# EAGLE design led80tiny85 (EAGLE 9.5.2)
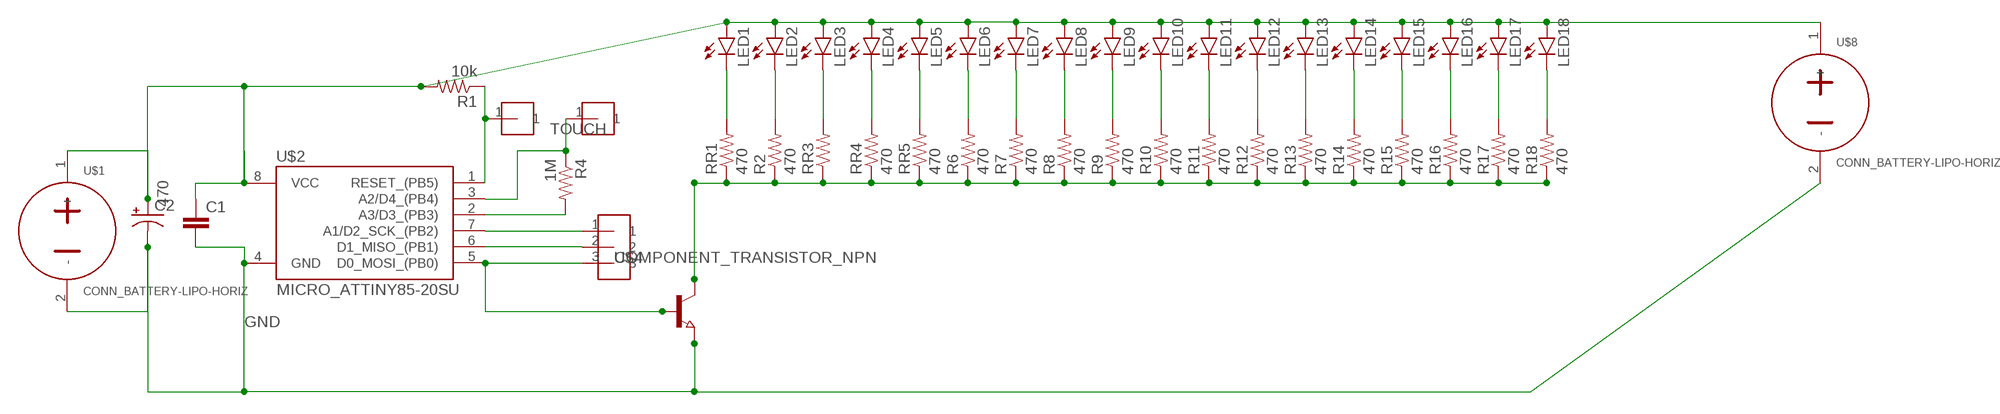
[diagram p0: schematic, sheet 1]

## Parts
C1  COMPONENT_CAP-0805  [0805]
C2  COMPONENT_CAP_POL-8MM  [CAP_RADIAL_CAN_6.3MM]
LED1  LED-0805  [CHIP-LED0805]
LED2  LED-0805  [CHIP-LED0805]
LED3  LED-0805  [CHIP-LED0805]
LED4  LED-0805  [CHIP-LED0805]
LED5  LED-0805  [CHIP-LED0805]
LED6  LED-0805  [CHIP-LED0805]
LED7  LED-0805  [CHIP-LED0805]
LED8  LED-0805  [CHIP-LED0805]
LED9  LED-0805  [CHIP-LED0805]
LED10  LED-0805  [CHIP-LED0805]
LED11  LED-0805  [CHIP-LED0805]
LED12  LED-0805  [CHIP-LED0805]
LED13  LED-0805  [CHIP-LED0805]
LED14  LED-0805  [CHIP-LED0805]
LED15  LED-0805  [CHIP-LED0805]
LED16  LED-0805  [CHIP-LED0805]
LED17  LED-0805  [CHIP-LED0805]
LED18  LED-0805  [CHIP-LED0805]
R1  10k  COMPONENT_RESISTOR-0805  [0805]
R2  470  COMPONENT_RESISTOR-0805  [0805]
R4  1M  COMPONENT_RESISTOR-0805  [0805]
R6  470  COMPONENT_RESISTOR-0805  [0805]
R7  470  COMPONENT_RESISTOR-0805  [0805]
R8  470  COMPONENT_RESISTOR-0805  [0805]
R9  470  COMPONENT_RESISTOR-0805  [0805]
R10  470  COMPONENT_RESISTOR-0805  [0805]
R11  470  COMPONENT_RESISTOR-0805  [0805]
R12  470  COMPONENT_RESISTOR-0805  [0805]
R13  470  COMPONENT_RESISTOR-0805  [0805]
R14  470  COMPONENT_RESISTOR-0805  [0805]
R15  470  COMPONENT_RESISTOR-0805  [0805]
R16  470  COMPONENT_RESISTOR-0805  [0805]
R17  470  COMPONENT_RESISTOR-0805  [0805]
R18  470  COMPONENT_RESISTOR-0805  [0805]
RR1  470  COMPONENT_RESISTOR-0805  [0805]
RR3  470  COMPONENT_RESISTOR-0805  [0805]
RR4  470  COMPONENT_RESISTOR-0805  [0805]
RR5  470  COMPONENT_RESISTOR-0805  [0805]
U$1  CONN_BATTERY-LIPO-HORIZ  [JST-PH-2-SMT-RA]
U$2  MICRO_ATTINY85-20SU  [SOIC8]
U$4  COMPONENT_TRANSISTOR_NPN  [SOT23]
U$5  HEADER-1-TESTPOINT  [TESTPOINT-1]
U$6  HEADER-1-TESTPOINT  [TESTPOINT-1]
U$7  HEADER-3-TESTPOINT  [TESTPOINT-3]
U$8  CONN_BATTERY-LIPO-HORIZ  [JST-PH-2-SMT-RA]

## Nets
GND: C1.2 C2.- U$1.2(-) U$2.4(GND) U$4.2(E) U$8.2(-)
N$1: R1.1 U$2.1(RESET_(PB5)) U$6.1
N$2: C1.1 C2.+ LED1.A LED2.A LED3.A LED4.A LED5.A LED6.A LED7.A LED8.A LED9.A LED10.A LED11.A LED12.A LED13.A LED14.A LED15.A LED16.A LED17.A LED18.A R1.2 U$1.1(+) U$2.8(VCC) U$8.1(+)
N$3: U$2.5(D0_MOSI_(PB0)) U$4.1(B) U$7.3
N$4: R2.1 R6.1 R7.1 R8.1 R9.1 R10.1 R11.1 R12.1 R13.1 R14.1 R15.1 R16.1 R17.1 R18.1 RR1.1 RR3.1 RR4.1 RR5.1 U$4.3(C)
N$6: R4.2 U$2.2(A3/D3_(PB3))
N$7: U$2.7(A1/D2_SCK_(PB2)) U$7.1
N$8: U$2.6(D1_MISO_(PB1)) U$7.2
N$9: LED1.C RR1.2
N$11: LED2.C R2.2
N$12: LED3.C RR3.2
N$13: LED4.C RR4.2
N$14: LED5.C RR5.2
N$15: LED6.C R6.2
N$16: LED7.C R7.2
N$17: LED8.C R8.2
N$18: LED9.C R9.2
N$19: LED10.C R10.2
N$20: LED11.C R11.2
N$21: LED12.C R12.2
N$22: LED13.C R13.2
N$23: LED14.C R14.2
N$24: LED15.C R15.2
N$25: LED16.C R16.2
N$27: LED17.C R17.2
N$28: LED18.C R18.2
TOUCH: R4.1 U$2.3(A2/D4_(PB4)) U$5.1

## Library data of the parts
C1 = homemade-hardware:COMPONENT_CAP: Capacitor Standard 0603 ceramic capacitor, and 0.1" leaded capacitor.
C2 = homemade-hardware:COMPONENT_CAP_POL: Capacitor Polarized These are standard SMD and PTH capacitors. Normally 47uF, 100uF, and 470uF in electrolytic and tantalum varieties. Always verify the external diameter of the through hole cap, it varies with capacity, voltage, and manufacturer. The EIA devices should be standard.
LED1-LED18 = homemade-hardware:LED: LEDs Standard schematic elements and footprints for 5mm, 3mm, 1206, and 0603 sized LEDs. 5mm - Spark Fun Electronics SKU : COM-00529 (and others)
R1 R2 R4 R6-R18 RR1 RR3-RR5 = homemade-hardware:COMPONENT_RESISTOR
U$1 U$8 = homemade-hardware:CONN_BATTERY
U$2 = homemade-hardware:MICRO_ATTINY85
U$4 = homemade-hardware:COMPONENT_TRANSISTOR_NPN: BSS806NH6327XTSA1 <https://www.digikey.com/product-detail/en/infineon-technologies/BSS806NH6327XTSA1/BSS806NH6327XTSA1DKR-ND/3196843>: NPN Moseft Transistor - 20V 2.3A; PN: BSS806NH6327XTSA1
U$5 U$6 = homemade-hardware:HEADER-1: M20-8890845 <https://www.digikey.com/products/en?keywords=952-3236-ND>: Horizontal Male SMD Headers M20-7910842R <https://www.digikey.com/product-detail/en/harwin-inc/M20-7910842R/952-3200-6-ND/6559341>: Horizontal Female SMD Headers
U$7 = homemade-hardware:HEADER-3: NPTC081KFXC-RC <https://www.digikey.com/product-detail/en/sullins-connector-solutions/NPTC081KFXC-RC/S5600-ND/776058>: Vertical Female SMD Headers TSM-110-01-T-SV <https://www.digikey.com/product-detail/en/samtec-inc/TSM-110-01-T-SV/SAM12267-ND/6691889>: Vertical Male SMD Headers M20-8890845 <https://www.digikey.com/products/en?keywords=952-3236-ND>: Horizontal Male SMD Headers M20-7910842R <https://www.digikey.com/product-detail/en/harwin-inc/M20-7910842R/952-3200-6-ND/6559341>: Horizontal Female SMD Headers

## Board
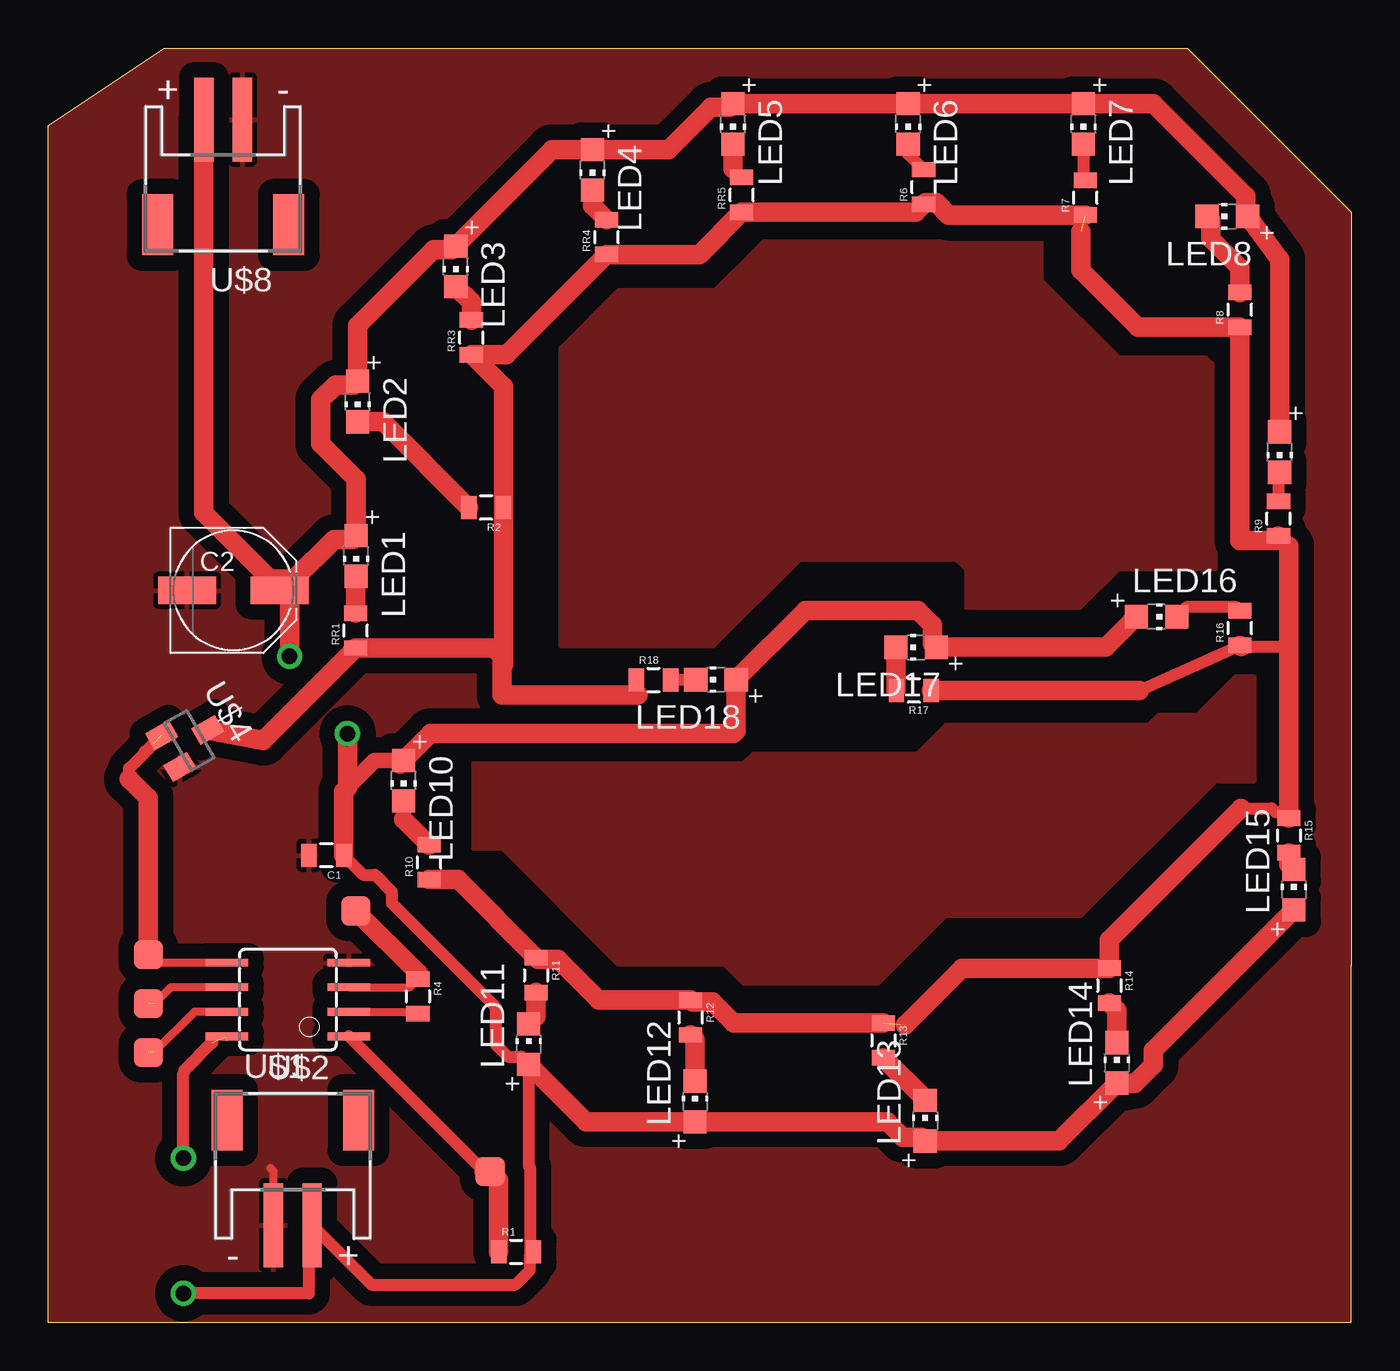
[diagram p1: board, top side]
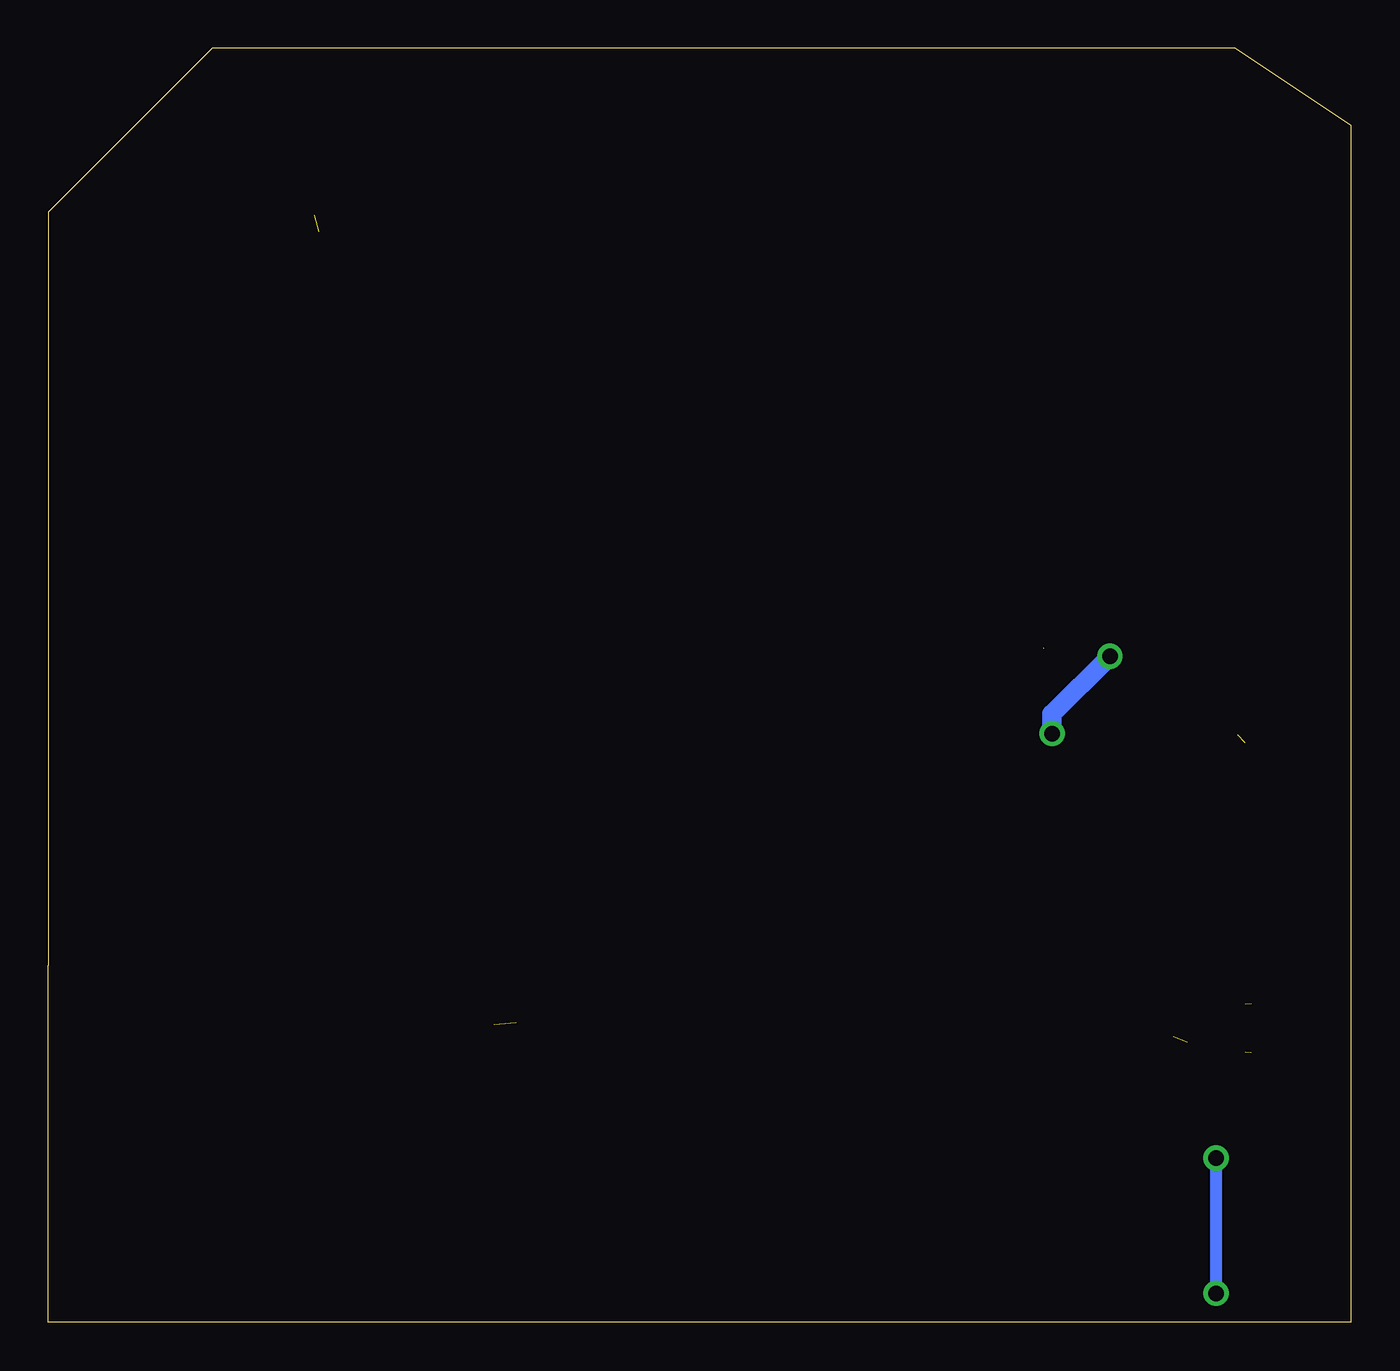
[diagram p2: board, bottom side, seen from below]

Size 67.5 x 66 mm. Coordinates in mm from the lower left corner, seen from the top.
Outline: 59,66 67.5,57.5 67.5,18.5 67.5,0 0,0 0,62 6,66 59,66
Copper layers (1*16): Top 0.035mm / dielectric 1.5mm / Bottom 0.035mm
Design rules "default": minimum track width 16mil, minimum drill 0.8mm, track to track 0.8mm, track to pad 0.8mm, pad to pad 0.8mm, via to via 0.8mm, smd to smd 0mil, copper to edge 1mil, drill to drill 1mil, minimum pad ring 10mil, minimum via ring 10mil, stop-mask expansion 1mil, vias tented up to drill 30mil, thermal gap 10mil

### Footprints (pad centres in the part's own frame; a part is rotated, then mirrored left to right if it is on the bottom)
0805 = smd 0.8 x 1.2: 1 -0.9,0; 2 0.9,0
CAP_RADIAL_CAN_6.3MM = smd 3 x 1.4: + 2.4,0; - -2.4,0
CHIP-LED0805 = smd 1.2 x 1.2: A 0,-1.05; C 0,1.05
JST-PH-2-SMT-RA = smd 1 x 4.35: 1 1,-3.825; 2 -1,-3.825 | smd 1.6 x 3.15: NC1 -3.4,1.625; NC2 3.4,1.625
SOIC8 = smd 0.4 x 2.2: 1 -1.905,-3.154; 2 -0.635,-3.154; 3 0.635,-3.154; 4 1.905,-3.154; 5 1.905,3.154; 6 0.635,3.154; 7 -0.635,3.154; 8 -1.905,3.154
SOT23 = smd 1 x 1.4: 1 -0.95,-1.1; 2 0.95,-1.1; 3 0,1.1
TESTPOINT-1 = smd 1.524 x 1.524: 1 0,0
TESTPOINT-3 = smd 1.524 x 1.524: 1 0,0; 2 2.54,0; 3 5.08,0

### Placement (x,y rotation side)
C1  14.41,24.19 180 top
C2  9.59,37.92 0 top
LED1  15.95,39.7 180 top
LED2  16.03,47.7 180 top
LED3  21.11,54.7 180 top
LED4  28.19,59.7 180 top
LED5  35.47,62.08 180 top
LED6  44.55,62.08 180 top
LED7  53.63,62.08 180 top
LED8  61.08,57.29 90 top
LED9  63.79,45.08 180 top
LED10  18.41,28.06 180 top
LED11  24.89,14.41 0 top
LED12  33.51,11.44 0 top
LED13  45.43,10.44 0 top
LED14  55.35,13.44 0 top
LED15  64.53,22.41 0 top
LED16  57.41,36.55 270 top
LED17  44.95,34.97 90 top
LED18  34.59,33.29 90 top
R1  24.24,3.65 0 top
R2  22.68,42.21 180 top
R4  19.15,16.88 270 top
R6  45.35,58.81 90 top
R7  53.73,58.26 90 top
R8  61.73,52.45 90 top
R9  63.73,41.64 90 top
R10  19.73,23.83 90 top
R11  25.27,17.98 270 top
R12  33.27,15.79 270 top
R13  43.27,14.6 270 top
R14  54.97,17.44 270 top
R15  64.27,25.22 270 top
R16  61.73,35.97 90 top
R17  44.84,32.73 180 top
R18  31.35,33.27 0 top
RR1  15.92,35.83 90 top
RR3  21.92,51.02 90 top
RR4  28.92,56.21 90 top
RR5  35.92,58.4 90 top
U$1  12.67,8.85 0 top
U$2  12.42,16.72 90 top
U$4  7.3,30.14 300 top
U$5  15.93,21.31 0 top
U$6  22.89,7.81 0 top
U$7  5.19,13.97 90 top
U$8  9.06,58.48 180 top

### Tracks (layer width: path | path; a pad name or v marks a point on that pad's centre or on a via)
DOWN
  pour Top: 22,29 36,29 36.5,29.5 45,29.5 46.5,31 57,31 57.5,31.5 59.5,31.5 61.5,33.5 62.5,33.5 62.5,28 60.5,28 53.5,21 46.5,21 43,17.5 36,17.5 35,18.5 29.5,18.5 23.5,24.5 22,24.5
GND
  Top 0.406: U$1.2 11.67,7.83 11.5,8
  pour Top: -0.5,68.5 -0.5,-1.5 67.5,-1.5 67.5,68.5
N$1
  Top 0.61: U$2.1 22.58,7.81
  Top 1.016: 22.58,7.81 U$6.1 23.34,7.36 R1.1
N$2  (via drill 0.8)  (1 unrouted)
  Top 0.406: U$2.8 9.23,14.77
  Top 0.61: 24.95,3.46 R1.2 | 24.95,3.46 24.95,2.7 24.2,1.95 16.75,1.95 U$1.1 13.5,4.85 13.5,1.5 v7,1.5 | 24.95,3.46 24.95,8.03 24.89,8.09 LED11.A 24.5,13.76 23.83,13.76 23.18,14.4 23.18,16.34 17.8,21.72 17.8,22.31 16.93,23.18 16.32,23.18 C1.1 | v7,8.5 7,12.92 7.06,12.97 7.06,13.06 8.5,14.5
  Top 0.813: 15.5,27.7 16.91,29.11 LED10.A
  Top 1.016: LED15.A 57.26,14.09 57.26,13.35 56.3,12.39 LED14.A 52.35,9.39 LED13.A 45.24,9.58 44.29,9.58 43.48,10.39 LED12.A 27.86,10.39 LED11.A 25.14,13.11 | 18.22,28.92 LED10.A 19.8,30.5 35.5,30.5 35.64,30.64 LED18.A 39.23,36.88 45.05,36.88 45.81,36.11 45.81,35.16 LED17.A 54.78,34.97 LED16.A | LED9.A 63.79,55.06 LED8.A 62.04,57.38 62.04,58.33 57.24,63.13 LED7.A LED6.A LED5.A 35.28,62.94 34.33,62.94 32.14,60.75 LED4.A 26.11,60.75 LED3.A 20.92,55.56 19.97,55.56 16.03,51.62 LED2.A 15.84,48.56 14.89,48.56 14.12,47.79 14.12,45.51 15.95,43.68 LED1.A 15.76,40.56 14.81,40.56 12.75,38.5 11.5,38.5 | U$8.1 8.06,41.94 11.5,38.5 | 11.5,38.5 11.5,38.41 C2.+ 12.5,37.41 v12.5,34.5 | C1.1 15.31,27.51 15.5,27.7 v15.5,30.5
  Bottom 0.61: v7,1.5 v7,8.5
  Bottom 1.016: v12.5,34.5 15.5,31.5 v15.5,30.5
N$3  (1 unrouted)
  Top 0.406: U$2.5 5.62,18.62 U$7.3
  Top 0.61: 4.19,28.15 4.19,28.69 5,29.49 5.02,29.58 5.16,29.66 5.5,30
  Top 1.016: U$7.3 5.19,27.15 4.19,28.15
N$4  (3 unrouted)
  Top 0.508: R9.1 64.27,40.2
  Top 0.61: 56.53,32.73 R16.1 | R18.1 30.54,33.18 30.54,32.5 | 61.77,26.62 63.38,26.62 63.57,26.43 64.5,26.43 64.27,26.2 R15.1 | 61.8,35 64.27,35
  Top 1.016: 61.77,26.62 54.97,19.82 R14.1 47.34,18.34 44.41,15.41 | R17.1 56.53,32.73 | R9.1 63.73,40.5 61.73,40.5 R8.1 56.45,51.55 53.5,54.5 53.5,56.5 | R7.1 46.64,57.36 46,58 45.44,58 R6.1 44.94,57.5 RR5.1 33.73,55.31 RR4.1 23.73,50.12 RR3.1 23.58,48.46 R2.1 23.58,34.08 23.5,34 | 23.5,34 23.5,34.5 23.07,34.93 RR1.1 | 23.5,34 23.5,32.5 30.54,32.5 | 15.92,34.91 15.9,34.91 11.13,30.14 U$4.3 | R10.1 21.22,22.93 R11.1 25.36,18.79 26.41,18.79 28.51,16.69 R12.1 33.36,16.6 34.41,16.6 35.51,15.5 R13.1 | 64.27,40.2 64.27,35 R15.1 | R16.1 61.8,35
N$6
  Top 0.406: U$2.2 19.05,16.09
  Top 0.508: 19.05,16.09 R4.2
N$7  (1 unrouted)
  Top 0.406: U$2.7 7.58,16.09 5.5,14
N$8  (1 unrouted)
  Top 0.406: U$2.6 6.36,17.35 5.5,16.5
N$9
  Top 1.016: RR1.2 15.92,38.62 LED1.C
N$11
  Top 1.016: LED2.C 17.34,46.65 R2.2
N$12
  Top 1.016: RR3.2 21.92,52.84 LED3.C
N$13
  Top 0.61: LED4.C 28.19,57.84
  Top 1.016: 28.19,57.84 RR4.2
N$14
  Top 0.61: 35.47,59.75 RR5.2
  Top 1.016: LED5.C 35.47,59.75
N$15
  Top 0.61: LED6.C 44.55,60.51 R6.2
N$16
  Top 0.61: LED7.C 53.63,59.26 R7.2
N$17
  Top 1.016: LED8.C 60.22,57.1 60.22,56.15 61.73,54.64 R8.2
N$18
  Top 0.61: 63.73,43.97 R9.2
  Top 1.016: LED9.C 63.73,43.97
N$19
  Top 0.813: 18.41,26.05 LED10.C
  Top 1.016: R10.2 18.41,26.05
N$20
  Top 1.016: R11.2 25.27,15.84 LED11.C
N$21
  Top 1.016: R12.2 33.51,14.65 LED12.C
N$22
  Top 1.016: R13.2 45.43,11.54 LED13.C
N$23
  Top 1.016: R14.2 55.35,16.16 LED14.C
N$24
  Top 1.016: LED15.C 64.27,23.72 R15.2
N$25
  Top 0.61: R16.2 61.55,37.05 58.96,37.05 LED16.C
N$27
  Top 0.61: R17.2 43.91,32.77
  Top 1.016: 43.91,32.77 LED17.C
N$28
  Top 0.61: R18.2 32.27,33.29 LED18.C
TOUCH
  Top 0.406: U$2.3 18.73,17.35 R4.1
  Top 0.61: 19.15,18.09 R4.1
  Top 1.016: U$5.1 19.15,18.09
UP
  pour Top: 26.5,49 26.5,35 34.5,35 39,39.5 47,39.5 47.5,39 47.5,37 53.5,37 55.5,39 60.5,39 60.5,49.5 60,50 55.5,50 51.5,54 51.5,56 37,56 36.5,55.5 34.5,53.5 29.5,53.5 26.5,50.5